# EAGLE schematic hum_sens_test (EAGLE 9.5.0)
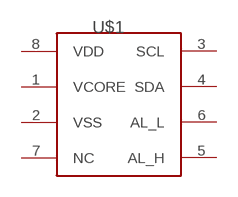
[diagram p0: schematic, sheet 1]

## Parts
U$1  HIH6030-021-001SMD  [HIH6030-021-001]
Unconnected: U$1.1(VCORE) U$1.2(VSS) U$1.3(SCL) U$1.4(SDA) U$1.5(AL_H) U$1.6(AL_L) U$1.7(NC)

## Power pins joined to a net without a drawn wire
VDD: U$1.8(VDD)

## Library data of the parts
U$1 = HIH6030-021-001:HIH6030-021-001: HIH6030-021-001 Honeywell HumidIconTM Digital Humidity/Temperature Sensors